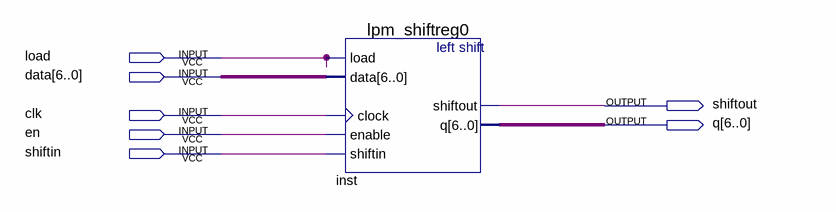
[diagram p0: schematic sheet]
// Quartus schematic lab_10.bdf as structural Verilog: 1 symbols, 7 pins
module lab_10 (
  input  load,
  input  [6:0] data,
  input  clk,
  input  en,
  input  shiftin,
  output shiftout,
  output [6:0] q
);

  lpm_shiftreg0 inst (
    .load(load), .data(data), .clock(clk), .enable(en), .shiftin(shiftin), .shiftout(shiftout), .q(q));
endmodule
